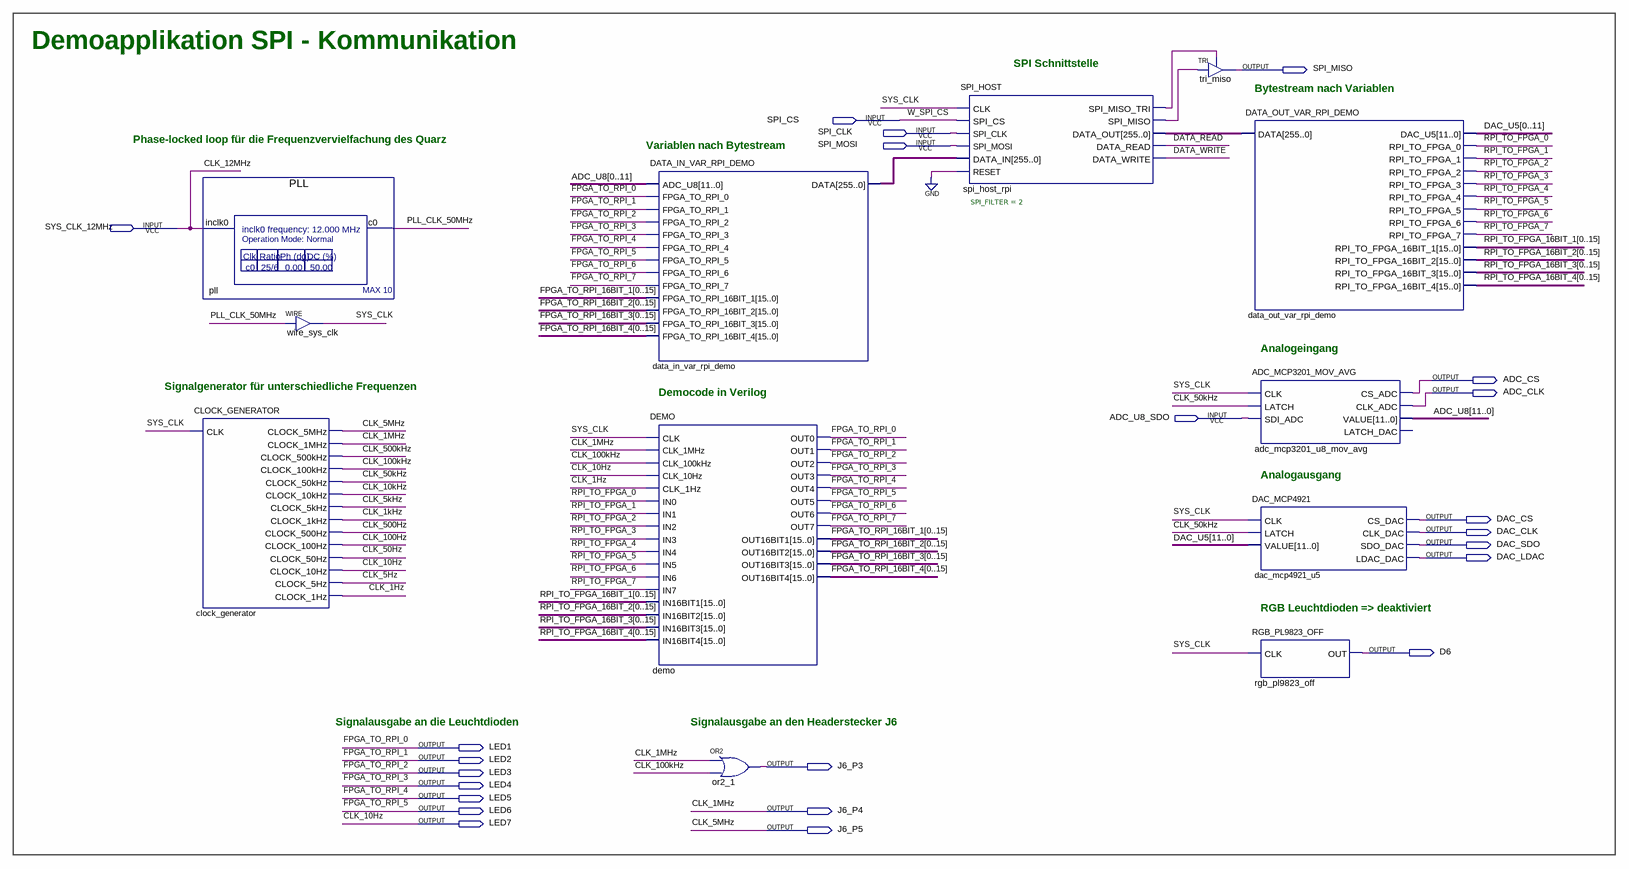
[diagram p0: schematic sheet]
// Quartus schematic MAX1000_DEMO.bdf as structural Verilog: 12 symbols, 23 pins
module MAX1000_DEMO (
  input  SPI_CS,
  input  SPI_CLK,
  input  SPI_MOSI,
  input  SYS_CLK_12MHz,
  input  ADC_U8_SDO,
  output SPI_MISO,
  output ADC_CS,
  output ADC_CLK,
  output DAC_CS,
  output DAC_CLK,
  output DAC_SDO,
  output DAC_LDAC,
  output D6,
  output LED1,
  output LED2,
  output J6_P3,
  output LED3,
  output LED4,
  output LED5,
  output LED6,
  output J6_P4,
  output LED7,
  output J6_P5
);

  wire CLK_1Hz, CLK_1kHz, CLK_5Hz, CLK_5kHz, CLK_10kHz, CLK_50Hz, CLK_50kHz, CLK_100Hz, CLK_100kHz,
       CLK_500Hz, CLK_500kHz, DATA_READ, DATA_WRITE, FPGA_TO_RPI_6, FPGA_TO_RPI_7, PLL_CLK_50MHz,
       RPI_TO_FPGA_0, RPI_TO_FPGA_1, RPI_TO_FPGA_2, RPI_TO_FPGA_3, RPI_TO_FPGA_4, RPI_TO_FPGA_5,
       RPI_TO_FPGA_6, RPI_TO_FPGA_7, spi_host_rpi_spi_miso, spi_host_rpi_spi_miso_tri, SYS_CLK;
  wire [11:0] ADC_U8, DAC_U5;
  wire [15:0] FPGA_TO_RPI_16BIT_1, FPGA_TO_RPI_16BIT_2, FPGA_TO_RPI_16BIT_3, FPGA_TO_RPI_16BIT_4,
       RPI_TO_FPGA_16BIT_1, RPI_TO_FPGA_16BIT_2, RPI_TO_FPGA_16BIT_3, RPI_TO_FPGA_16BIT_4;
  wire [255:0] data_in_var_rpi_demo_data, spi_host_rpi_data_out;

  PLL pll (.inclk0(SYS_CLK_12MHz), .c0(PLL_CLK_50MHz));
  CLOCK_GENERATOR clock_generator (
    .CLK(SYS_CLK), .CLOCK_5MHz(J6_P5), .CLOCK_1MHz(J6_P4), .CLOCK_500kHz(CLK_500kHz),
    .CLOCK_100kHz(CLK_100kHz), .CLOCK_50kHz(CLK_50kHz), .CLOCK_10kHz(CLK_10kHz), .CLOCK_5kHz(CLK_5kHz),
    .CLOCK_1kHz(CLK_1kHz), .CLOCK_500Hz(CLK_500Hz), .CLOCK_100Hz(CLK_100Hz), .CLOCK_50Hz(CLK_50Hz),
    .CLOCK_10Hz(LED7), .CLOCK_5Hz(CLK_5Hz), .CLOCK_1Hz(CLK_1Hz));
  assign SYS_CLK = PLL_CLK_50MHz;  // WIRE wire_sys_clk
  DATA_IN_VAR_RPI_DEMO data_in_var_rpi_demo (
    .ADC_U8({ADC_U8[0], ADC_U8[1], ADC_U8[2], ADC_U8[3], ADC_U8[4], ADC_U8[5], ADC_U8[6], ADC_U8[7], ADC_U8[8], ADC_U8[9], ADC_U8[10], ADC_U8[11]}),
    .FPGA_TO_RPI_0(LED1), .FPGA_TO_RPI_1(LED2), .FPGA_TO_RPI_2(LED3), .FPGA_TO_RPI_3(LED4),
    .FPGA_TO_RPI_4(LED5), .FPGA_TO_RPI_5(LED6), .FPGA_TO_RPI_6(FPGA_TO_RPI_6), .FPGA_TO_RPI_7(FPGA_TO_RPI_7),
    .FPGA_TO_RPI_16BIT_1({FPGA_TO_RPI_16BIT_1[0], FPGA_TO_RPI_16BIT_1[1], FPGA_TO_RPI_16BIT_1[2], FPGA_TO_RPI_16BIT_1[3], FPGA_TO_RPI_16BIT_1[4], FPGA_TO_RPI_16BIT_1[5], FPGA_TO_RPI_16BIT_1[6], FPGA_TO_RPI_16BIT_1[7], FPGA_TO_RPI_16BIT_1[8], FPGA_TO_RPI_16BIT_1[9], FPGA_TO_RPI_16BIT_1[10], FPGA_TO_RPI_16BIT_1[11], FPGA_TO_RPI_16BIT_1[12], FPGA_TO_RPI_16BIT_1[13], FPGA_TO_RPI_16BIT_1[14], FPGA_TO_RPI_16BIT_1[15]}),
    .FPGA_TO_RPI_16BIT_2({FPGA_TO_RPI_16BIT_2[0], FPGA_TO_RPI_16BIT_2[1], FPGA_TO_RPI_16BIT_2[2], FPGA_TO_RPI_16BIT_2[3], FPGA_TO_RPI_16BIT_2[4], FPGA_TO_RPI_16BIT_2[5], FPGA_TO_RPI_16BIT_2[6], FPGA_TO_RPI_16BIT_2[7], FPGA_TO_RPI_16BIT_2[8], FPGA_TO_RPI_16BIT_2[9], FPGA_TO_RPI_16BIT_2[10], FPGA_TO_RPI_16BIT_2[11], FPGA_TO_RPI_16BIT_2[12], FPGA_TO_RPI_16BIT_2[13], FPGA_TO_RPI_16BIT_2[14], FPGA_TO_RPI_16BIT_2[15]}),
    .FPGA_TO_RPI_16BIT_3({FPGA_TO_RPI_16BIT_3[0], FPGA_TO_RPI_16BIT_3[1], FPGA_TO_RPI_16BIT_3[2], FPGA_TO_RPI_16BIT_3[3], FPGA_TO_RPI_16BIT_3[4], FPGA_TO_RPI_16BIT_3[5], FPGA_TO_RPI_16BIT_3[6], FPGA_TO_RPI_16BIT_3[7], FPGA_TO_RPI_16BIT_3[8], FPGA_TO_RPI_16BIT_3[9], FPGA_TO_RPI_16BIT_3[10], FPGA_TO_RPI_16BIT_3[11], FPGA_TO_RPI_16BIT_3[12], FPGA_TO_RPI_16BIT_3[13], FPGA_TO_RPI_16BIT_3[14], FPGA_TO_RPI_16BIT_3[15]}),
    .FPGA_TO_RPI_16BIT_4({FPGA_TO_RPI_16BIT_4[0], FPGA_TO_RPI_16BIT_4[1], FPGA_TO_RPI_16BIT_4[2], FPGA_TO_RPI_16BIT_4[3], FPGA_TO_RPI_16BIT_4[4], FPGA_TO_RPI_16BIT_4[5], FPGA_TO_RPI_16BIT_4[6], FPGA_TO_RPI_16BIT_4[7], FPGA_TO_RPI_16BIT_4[8], FPGA_TO_RPI_16BIT_4[9], FPGA_TO_RPI_16BIT_4[10], FPGA_TO_RPI_16BIT_4[11], FPGA_TO_RPI_16BIT_4[12], FPGA_TO_RPI_16BIT_4[13], FPGA_TO_RPI_16BIT_4[14], FPGA_TO_RPI_16BIT_4[15]}),
    .DATA(data_in_var_rpi_demo_data));
  DEMO demo (
    .CLK(SYS_CLK), .CLK_1MHz(J6_P4), .CLK_100kHz(CLK_100kHz), .CLK_10Hz(LED7), .CLK_1Hz(CLK_1Hz),
    .IN0(RPI_TO_FPGA_0), .IN1(RPI_TO_FPGA_1), .IN2(RPI_TO_FPGA_2), .IN3(RPI_TO_FPGA_3), .IN4(RPI_TO_FPGA_4),
    .IN5(RPI_TO_FPGA_5), .IN6(RPI_TO_FPGA_6), .IN7(RPI_TO_FPGA_7),
    .IN16BIT1({RPI_TO_FPGA_16BIT_1[0], RPI_TO_FPGA_16BIT_1[1], RPI_TO_FPGA_16BIT_1[2], RPI_TO_FPGA_16BIT_1[3], RPI_TO_FPGA_16BIT_1[4], RPI_TO_FPGA_16BIT_1[5], RPI_TO_FPGA_16BIT_1[6], RPI_TO_FPGA_16BIT_1[7], RPI_TO_FPGA_16BIT_1[8], RPI_TO_FPGA_16BIT_1[9], RPI_TO_FPGA_16BIT_1[10], RPI_TO_FPGA_16BIT_1[11], RPI_TO_FPGA_16BIT_1[12], RPI_TO_FPGA_16BIT_1[13], RPI_TO_FPGA_16BIT_1[14], RPI_TO_FPGA_16BIT_1[15]}),
    .IN16BIT2({RPI_TO_FPGA_16BIT_2[0], RPI_TO_FPGA_16BIT_2[1], RPI_TO_FPGA_16BIT_2[2], RPI_TO_FPGA_16BIT_2[3], RPI_TO_FPGA_16BIT_2[4], RPI_TO_FPGA_16BIT_2[5], RPI_TO_FPGA_16BIT_2[6], RPI_TO_FPGA_16BIT_2[7], RPI_TO_FPGA_16BIT_2[8], RPI_TO_FPGA_16BIT_2[9], RPI_TO_FPGA_16BIT_2[10], RPI_TO_FPGA_16BIT_2[11], RPI_TO_FPGA_16BIT_2[12], RPI_TO_FPGA_16BIT_2[13], RPI_TO_FPGA_16BIT_2[14], RPI_TO_FPGA_16BIT_2[15]}),
    .IN16BIT3({RPI_TO_FPGA_16BIT_3[0], RPI_TO_FPGA_16BIT_3[1], RPI_TO_FPGA_16BIT_3[2], RPI_TO_FPGA_16BIT_3[3], RPI_TO_FPGA_16BIT_3[4], RPI_TO_FPGA_16BIT_3[5], RPI_TO_FPGA_16BIT_3[6], RPI_TO_FPGA_16BIT_3[7], RPI_TO_FPGA_16BIT_3[8], RPI_TO_FPGA_16BIT_3[9], RPI_TO_FPGA_16BIT_3[10], RPI_TO_FPGA_16BIT_3[11], RPI_TO_FPGA_16BIT_3[12], RPI_TO_FPGA_16BIT_3[13], RPI_TO_FPGA_16BIT_3[14], RPI_TO_FPGA_16BIT_3[15]}),
    .IN16BIT4({RPI_TO_FPGA_16BIT_4[0], RPI_TO_FPGA_16BIT_4[1], RPI_TO_FPGA_16BIT_4[2], RPI_TO_FPGA_16BIT_4[3], RPI_TO_FPGA_16BIT_4[4], RPI_TO_FPGA_16BIT_4[5], RPI_TO_FPGA_16BIT_4[6], RPI_TO_FPGA_16BIT_4[7], RPI_TO_FPGA_16BIT_4[8], RPI_TO_FPGA_16BIT_4[9], RPI_TO_FPGA_16BIT_4[10], RPI_TO_FPGA_16BIT_4[11], RPI_TO_FPGA_16BIT_4[12], RPI_TO_FPGA_16BIT_4[13], RPI_TO_FPGA_16BIT_4[14], RPI_TO_FPGA_16BIT_4[15]}),
    .OUT0(LED1), .OUT1(LED2), .OUT2(LED3), .OUT3(LED4), .OUT4(LED5), .OUT5(LED6), .OUT6(FPGA_TO_RPI_6),
    .OUT7(FPGA_TO_RPI_7),
    .OUT16BIT1({FPGA_TO_RPI_16BIT_1[0], FPGA_TO_RPI_16BIT_1[1], FPGA_TO_RPI_16BIT_1[2], FPGA_TO_RPI_16BIT_1[3], FPGA_TO_RPI_16BIT_1[4], FPGA_TO_RPI_16BIT_1[5], FPGA_TO_RPI_16BIT_1[6], FPGA_TO_RPI_16BIT_1[7], FPGA_TO_RPI_16BIT_1[8], FPGA_TO_RPI_16BIT_1[9], FPGA_TO_RPI_16BIT_1[10], FPGA_TO_RPI_16BIT_1[11], FPGA_TO_RPI_16BIT_1[12], FPGA_TO_RPI_16BIT_1[13], FPGA_TO_RPI_16BIT_1[14], FPGA_TO_RPI_16BIT_1[15]}),
    .OUT16BIT2({FPGA_TO_RPI_16BIT_2[0], FPGA_TO_RPI_16BIT_2[1], FPGA_TO_RPI_16BIT_2[2], FPGA_TO_RPI_16BIT_2[3], FPGA_TO_RPI_16BIT_2[4], FPGA_TO_RPI_16BIT_2[5], FPGA_TO_RPI_16BIT_2[6], FPGA_TO_RPI_16BIT_2[7], FPGA_TO_RPI_16BIT_2[8], FPGA_TO_RPI_16BIT_2[9], FPGA_TO_RPI_16BIT_2[10], FPGA_TO_RPI_16BIT_2[11], FPGA_TO_RPI_16BIT_2[12], FPGA_TO_RPI_16BIT_2[13], FPGA_TO_RPI_16BIT_2[14], FPGA_TO_RPI_16BIT_2[15]}),
    .OUT16BIT3({FPGA_TO_RPI_16BIT_3[0], FPGA_TO_RPI_16BIT_3[1], FPGA_TO_RPI_16BIT_3[2], FPGA_TO_RPI_16BIT_3[3], FPGA_TO_RPI_16BIT_3[4], FPGA_TO_RPI_16BIT_3[5], FPGA_TO_RPI_16BIT_3[6], FPGA_TO_RPI_16BIT_3[7], FPGA_TO_RPI_16BIT_3[8], FPGA_TO_RPI_16BIT_3[9], FPGA_TO_RPI_16BIT_3[10], FPGA_TO_RPI_16BIT_3[11], FPGA_TO_RPI_16BIT_3[12], FPGA_TO_RPI_16BIT_3[13], FPGA_TO_RPI_16BIT_3[14], FPGA_TO_RPI_16BIT_3[15]}),
    .OUT16BIT4({FPGA_TO_RPI_16BIT_4[0], FPGA_TO_RPI_16BIT_4[1], FPGA_TO_RPI_16BIT_4[2], FPGA_TO_RPI_16BIT_4[3], FPGA_TO_RPI_16BIT_4[4], FPGA_TO_RPI_16BIT_4[5], FPGA_TO_RPI_16BIT_4[6], FPGA_TO_RPI_16BIT_4[7], FPGA_TO_RPI_16BIT_4[8], FPGA_TO_RPI_16BIT_4[9], FPGA_TO_RPI_16BIT_4[10], FPGA_TO_RPI_16BIT_4[11], FPGA_TO_RPI_16BIT_4[12], FPGA_TO_RPI_16BIT_4[13], FPGA_TO_RPI_16BIT_4[14], FPGA_TO_RPI_16BIT_4[15]}));
  or or2_1 (J6_P3, J6_P4, CLK_100kHz);
  SPI_HOST #(.SPI_FILTER(2)) spi_host_rpi (
    .CLK(SYS_CLK), .SPI_CS(SPI_CS), .SPI_CLK(SPI_CLK), .SPI_MOSI(SPI_MOSI),
    .DATA_IN(data_in_var_rpi_demo_data), .RESET(1'b0), .SPI_MISO_TRI(spi_host_rpi_spi_miso_tri),
    .SPI_MISO(spi_host_rpi_spi_miso), .DATA_OUT(spi_host_rpi_data_out), .DATA_READ(DATA_READ),
    .DATA_WRITE(DATA_WRITE));
  TRI tri_miso (.IN(spi_host_rpi_spi_miso), .OE(spi_host_rpi_spi_miso_tri), .OUT(SPI_MISO));
  DATA_OUT_VAR_RPI_DEMO data_out_var_rpi_demo (
    .DATA(spi_host_rpi_data_out),
    .DAC_U5({DAC_U5[0], DAC_U5[1], DAC_U5[2], DAC_U5[3], DAC_U5[4], DAC_U5[5], DAC_U5[6], DAC_U5[7], DAC_U5[8], DAC_U5[9], DAC_U5[10], DAC_U5[11]}),
    .RPI_TO_FPGA_0(RPI_TO_FPGA_0), .RPI_TO_FPGA_1(RPI_TO_FPGA_1), .RPI_TO_FPGA_2(RPI_TO_FPGA_2),
    .RPI_TO_FPGA_3(RPI_TO_FPGA_3), .RPI_TO_FPGA_4(RPI_TO_FPGA_4), .RPI_TO_FPGA_5(RPI_TO_FPGA_5),
    .RPI_TO_FPGA_6(RPI_TO_FPGA_6), .RPI_TO_FPGA_7(RPI_TO_FPGA_7),
    .RPI_TO_FPGA_16BIT_1({RPI_TO_FPGA_16BIT_1[0], RPI_TO_FPGA_16BIT_1[1], RPI_TO_FPGA_16BIT_1[2], RPI_TO_FPGA_16BIT_1[3], RPI_TO_FPGA_16BIT_1[4], RPI_TO_FPGA_16BIT_1[5], RPI_TO_FPGA_16BIT_1[6], RPI_TO_FPGA_16BIT_1[7], RPI_TO_FPGA_16BIT_1[8], RPI_TO_FPGA_16BIT_1[9], RPI_TO_FPGA_16BIT_1[10], RPI_TO_FPGA_16BIT_1[11], RPI_TO_FPGA_16BIT_1[12], RPI_TO_FPGA_16BIT_1[13], RPI_TO_FPGA_16BIT_1[14], RPI_TO_FPGA_16BIT_1[15]}),
    .RPI_TO_FPGA_16BIT_2({RPI_TO_FPGA_16BIT_2[0], RPI_TO_FPGA_16BIT_2[1], RPI_TO_FPGA_16BIT_2[2], RPI_TO_FPGA_16BIT_2[3], RPI_TO_FPGA_16BIT_2[4], RPI_TO_FPGA_16BIT_2[5], RPI_TO_FPGA_16BIT_2[6], RPI_TO_FPGA_16BIT_2[7], RPI_TO_FPGA_16BIT_2[8], RPI_TO_FPGA_16BIT_2[9], RPI_TO_FPGA_16BIT_2[10], RPI_TO_FPGA_16BIT_2[11], RPI_TO_FPGA_16BIT_2[12], RPI_TO_FPGA_16BIT_2[13], RPI_TO_FPGA_16BIT_2[14], RPI_TO_FPGA_16BIT_2[15]}),
    .RPI_TO_FPGA_16BIT_3({RPI_TO_FPGA_16BIT_3[0], RPI_TO_FPGA_16BIT_3[1], RPI_TO_FPGA_16BIT_3[2], RPI_TO_FPGA_16BIT_3[3], RPI_TO_FPGA_16BIT_3[4], RPI_TO_FPGA_16BIT_3[5], RPI_TO_FPGA_16BIT_3[6], RPI_TO_FPGA_16BIT_3[7], RPI_TO_FPGA_16BIT_3[8], RPI_TO_FPGA_16BIT_3[9], RPI_TO_FPGA_16BIT_3[10], RPI_TO_FPGA_16BIT_3[11], RPI_TO_FPGA_16BIT_3[12], RPI_TO_FPGA_16BIT_3[13], RPI_TO_FPGA_16BIT_3[14], RPI_TO_FPGA_16BIT_3[15]}),
    .RPI_TO_FPGA_16BIT_4({RPI_TO_FPGA_16BIT_4[0], RPI_TO_FPGA_16BIT_4[1], RPI_TO_FPGA_16BIT_4[2], RPI_TO_FPGA_16BIT_4[3], RPI_TO_FPGA_16BIT_4[4], RPI_TO_FPGA_16BIT_4[5], RPI_TO_FPGA_16BIT_4[6], RPI_TO_FPGA_16BIT_4[7], RPI_TO_FPGA_16BIT_4[8], RPI_TO_FPGA_16BIT_4[9], RPI_TO_FPGA_16BIT_4[10], RPI_TO_FPGA_16BIT_4[11], RPI_TO_FPGA_16BIT_4[12], RPI_TO_FPGA_16BIT_4[13], RPI_TO_FPGA_16BIT_4[14], RPI_TO_FPGA_16BIT_4[15]}));
  ADC_MCP3201_MOV_AVG adc_mcp3201_u8_mov_avg (
    .CLK(SYS_CLK), .LATCH(CLK_50kHz), .SDI_ADC(ADC_U8_SDO), .CS_ADC(ADC_CS), .CLK_ADC(ADC_CLK), .VALUE(ADC_U8));  // open: LATCH_DAC
  DAC_MCP4921 dac_mcp4921_u5 (
    .CLK(SYS_CLK), .LATCH(CLK_50kHz), .VALUE(DAC_U5), .CS_DAC(DAC_CS), .CLK_DAC(DAC_CLK), .SDO_DAC(DAC_SDO),
    .LDAC_DAC(DAC_LDAC));
  RGB_PL9823_OFF rgb_pl9823_off (.CLK(SYS_CLK), .OUT(D6));

  // Other names for the same wires on the sheet: CLK_1MHz = J6_P4; CLK_5MHz = J6_P5; CLK_10Hz = LED7;
  //   FPGA_TO_RPI_0 = LED1; FPGA_TO_RPI_1 = LED2; FPGA_TO_RPI_2 = LED3; FPGA_TO_RPI_3 = LED4; FPGA_TO_RPI_4 = LED5;
  //   FPGA_TO_RPI_5 = LED6; CLK_12MHz = SYS_CLK_12MHz; W_SPI_CS = SPI_CS

  // Notes on the sheet:
  //   Demoapplikation SPI - Kommunikation
  //   SPI Schnittstelle
  //   Bytestream nach Variablen
  //   Phase-locked loop für die Frequenzvervielfachung des Quarz
  //   Variablen nach Bytestream
  //   Analogeingang
  //   Signalgenerator für unterschiedliche Frequenzen
  //   Democode in Verilog
  //   Analogausgang
  //   RGB Leuchtdioden => deaktiviert
  //   Signalausgabe an die Leuchtdioden
  //   Signalausgabe an den Headerstecker J6
endmodule
